# Altium schematic sheet Dumber.SchDoc
size A4
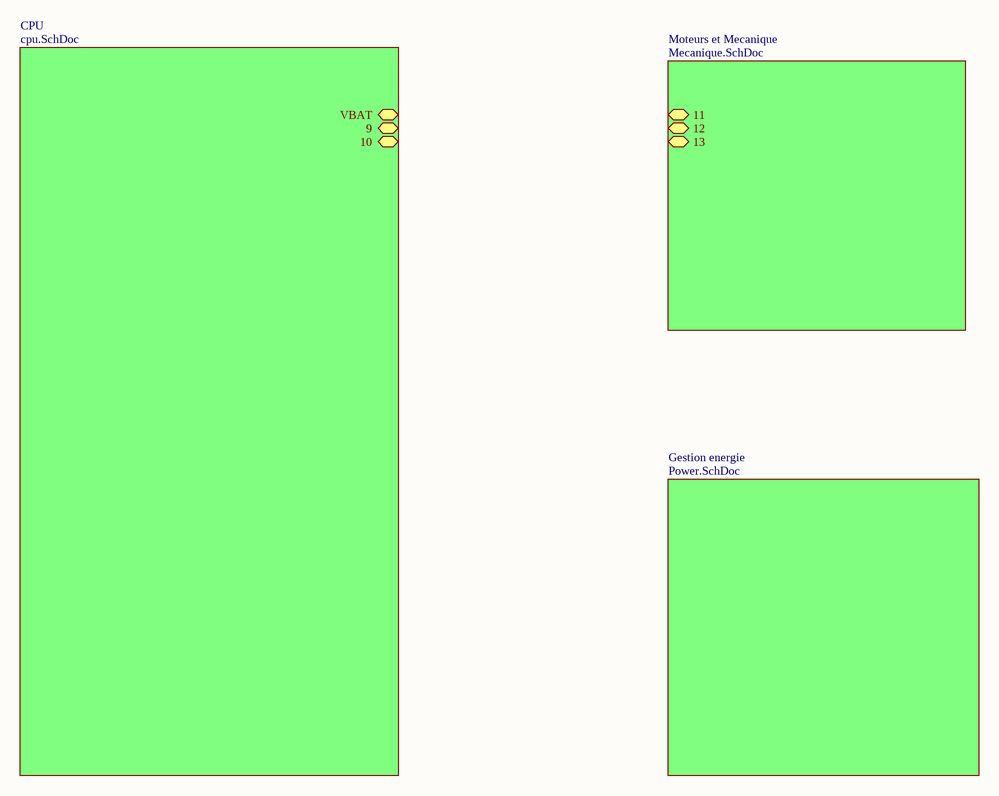
[diagram p0: Dumber.SchDoc]

## Sub-sheets
CPU = cpu.SchDoc: VBAT, 9, 10
Gestion energie = Power.SchDoc: no entries
Moteurs et Mecanique = Mecanique.SchDoc: 11, 12, 13